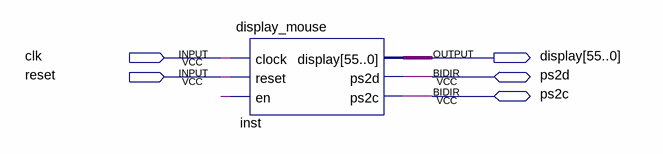
[diagram p0: schematic sheet]
// Quartus schematic Block.bdf as structural Verilog: 1 symbols, 5 pins
module Block (
  input  clk,
  input  reset,
  inout  ps2d,
  inout  ps2c,
  output [55:0] display
);

  wire undriven;

  display_mouse inst (.clock(clk), .reset(reset), .en(undriven), .display(display), .ps2d(ps2d), .ps2c(ps2c));
endmodule
